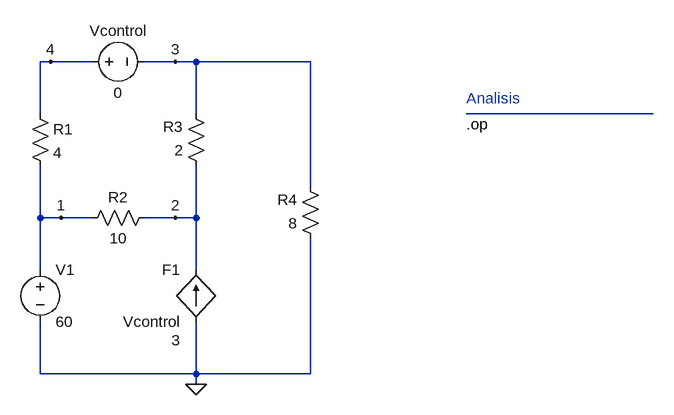
[diagram p0: schematic ejemplo2_voltajes_nodos.asc]
ejemplo2_voltajes_nodos.asc, the LTspice schematic file:
Version 4
SHEET 1 880 680
WIRE -256 -32 -272 -32
WIRE -192 -32 -256 -32
WIRE -64 -32 -112 -32
WIRE -32 -32 -64 -32
WIRE 144 -32 -32 -32
WIRE -272 48 -272 -32
WIRE -32 48 -32 -32
WIRE 672 48 384 48
WIRE 144 160 144 -32
WIRE -272 208 -272 128
WIRE -240 208 -272 208
WIRE -192 208 -240 208
WIRE -64 208 -112 208
WIRE -32 208 -32 128
WIRE -32 208 -64 208
WIRE -272 288 -272 208
WIRE -32 288 -32 208
WIRE -272 448 -272 368
WIRE -32 448 -32 368
WIRE -32 448 -272 448
WIRE 144 448 144 240
WIRE 144 448 -32 448
WIRE -32 464 -32 448
FLAG -32 464 0
FLAG -240 208 1
FLAG -64 208 2
FLAG -64 -32 3
FLAG -256 -32 4
SYMBOL f -32 368 R180
WINDOW 0 24 80 Left 2
WINDOW 3 24 0 Left 2
WINDOW 123 24 -28 Left 2
SYMATTR InstName F1
SYMATTR Value Vcontrol
SYMATTR Value2 3
SYMBOL voltage -272 272 R0
SYMATTR InstName V1
SYMATTR Value 60
SYMBOL voltage -208 -32 R270
WINDOW 0 32 56 VTop 2
WINDOW 3 -32 56 VBottom 2
SYMATTR InstName Vcontrol
SYMATTR Value 0
SYMBOL res -288 32 R0
SYMATTR InstName R1
SYMATTR Value 4
SYMBOL res -96 192 R90
WINDOW 0 0 56 VBottom 2
WINDOW 3 32 56 VTop 2
SYMATTR InstName R2
SYMATTR Value 10
SYMBOL res -16 144 R180
WINDOW 0 36 76 Left 2
WINDOW 3 36 40 Left 2
SYMATTR InstName R3
SYMATTR Value 2
SYMBOL res 160 256 R180
WINDOW 0 36 76 Left 2
WINDOW 3 36 40 Left 2
SYMATTR InstName R4
SYMATTR Value 8
TEXT 384 64 Left 2 !.op
TEXT 384 24 Left 2 ;Analisis

The netlist it stands for:
* ejemplo2_voltajes_nodos.asc
F1 0 2 Vcontrol 3
V1 1 0 60
Vcontrol 4 3 0
R1 4 1 4
R2 2 1 10
R3 2 3 2
R4 0 3 8
.op
* Analisis
.backanno
.end